# Altium schematic sheet IO_MIL1553_TopConfiguration.SchDoc
size A3; SheetNumber: 13; SheetTotal: 14
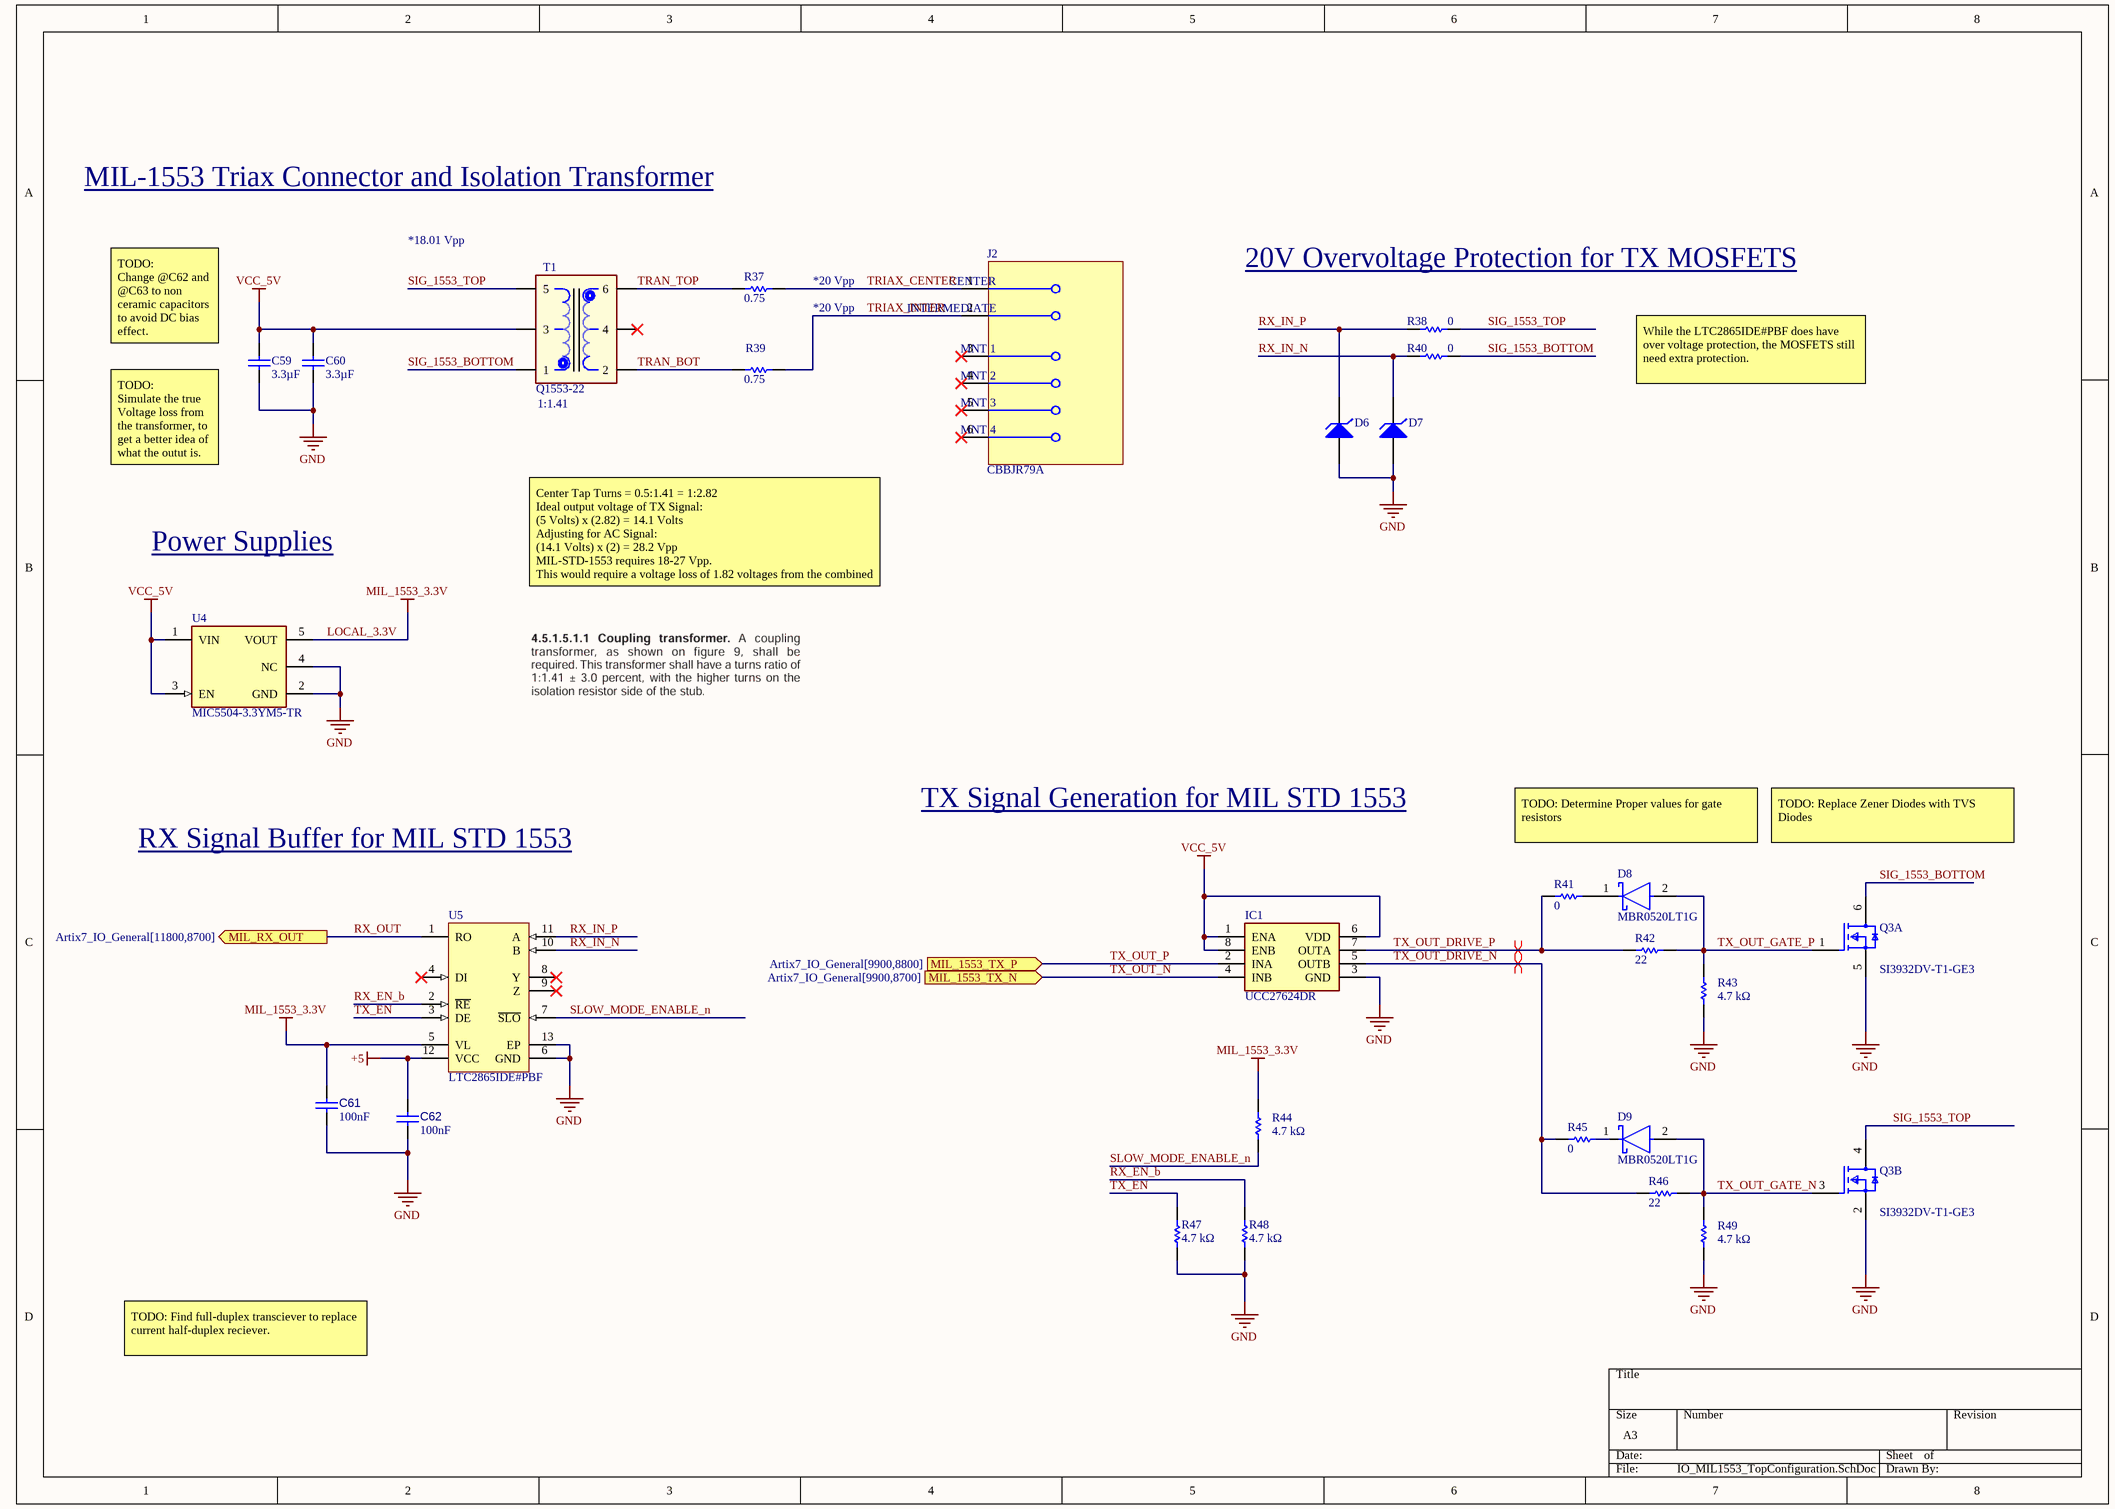
[diagram p0: IO_MIL1553_TopConfiguration.SchDoc]

## Parts
C59  value 3.3µF  [CAPC3325X279X50NL40T25]  (hidden comment: 12105C335KAT2A)
C60  value 3.3µF  [CAPC3325X279X50NL40T25]  (hidden comment: 12105C335KAT2A)
C61  value 100nF  [CAPC2013X145X48ML20T23]  (hidden comment: VJ0805Y104JXXAT)
C62  value 100nF  [CAPC2013X145X48ML20T23]  (hidden comment: VJ0805Y104JXXAT)
D6  SZ1SMA5932BT3G  [ONSC-SMA-2-403D-02_F_V]  (value not drawn)
D7  SZ1SMA5932BT3G  [ONSC-SMA-2-403D-02_F_V]  (value not drawn)
D8  MBR0520LT1G  [FP-425-04-IPC_A]
D9  MBR0520LT1G  [FP-425-04-IPC_A]
IC1  UCC27624DR  [SOIC127P600X175-8N]
J2  CBBJR79A  [CBBJR79A_MFG]
Q3  SI3932DV-T1-GE3  [FP-C-06593-6-IPC_B]  (parts A,B of 2)
R37  value 0.75  [RESC3125X70X40LL20T20]  (hidden comment: RES_0.75ohm_1W _1210)
R38  value 0  [RESC1608X55X25ML10T15]  (hidden comment: Resistor 0R +/- 5% 0603 100 mW)
R39  value 0.75  [RESC3125X70X40LL20T20]  (hidden comment: RES_0.75ohm_1W _1210)
R40  value 0  [RESC1608X55X25ML10T15]  (hidden comment: Resistor 0R +/- 5% 0603 100 mW)
R41  value 0  [RESC1608X55X25ML10T15]  (hidden comment: Resistor 0R +/- 5% 0603 100 mW)
R42  value 22  [RESC1608X55X25LL10T15]  (hidden comment: RC0603FR-0722RL)
R43  Resistance: 4.7 kΩ  [RESC1608X55X30LL15T15]  (hidden comment: ERJ-3EKF4701V)
R44  Resistance: 4.7 kΩ  [RESC1608X55X30LL15T15]  (hidden comment: ERJ-3EKF4701V)
R45  value 0  [RESC1608X55X25ML10T15]  (hidden comment: Resistor 0R +/- 5% 0603 100 mW)
R46  value 22  [RESC1608X55X25LL10T15]  (hidden comment: RC0603FR-0722RL)
R47  Resistance: 4.7 kΩ  [RESC1608X55X30LL15T15]  (hidden comment: ERJ-3EKF4701V)
R48  Resistance: 4.7 kΩ  [RESC1608X55X30LL15T15]  (hidden comment: ERJ-3EKF4701V)
R49  Resistance: 4.7 kΩ  [RESC1608X55X30LL15T15]  (hidden comment: ERJ-3EKF4701V)
T1  Turns Ratio: 1:1.41  [New footprint 1]  (hidden comment: Q1553-22)
U4  MIC5504-3.3YM5-TR  [FP-SOT23-5LD-PL-1-MFG]
U5  LTC2865IDE#PBF  [LT-DE-UE-12_V]

## Ports
MIL_1553_TX_N (in, see Artix7_IO_General[9900,8700]), MIL_1553_TX_P (in, see Artix7_IO_General[9900,8800]), MIL_RX_OUT (out, see Artix7_IO_General[11800,8700])

## Nets
+5: C62.2 U5.12(VCC)
GND: C59.1 C60.1 C61.1 C62.1 D6.2(A) D7.2(A) IC1.3(GND) Q3.2(S2) Q3.5(S1) R43.1 R47.1 R48.2 R49.1 U4.2(GND) U4.4(NC) U5.6(GND) U5.13(EP)
LOCAL_3.3V: C61.2 R44.2 U4.5(VOUT) U5.5(VL)  [also labelled MIL_1553_3.3V]
VCC_5V: C59.2 C60.2 IC1.1(ENA) IC1.6(VDD) IC1.8(ENB) T1.3 U4.1(VIN) U4.3(EN)
RX_EN_b: R48.1 U5.2(~{RE})
RX_IN_N: D7.1(K) R40.1 U5.10(B)
RX_IN_P: D6.1(K) R38.1 U5.11(A)
RX_OUT: U5.1(RO) ; port MIL_RX_OUT
SIG_1553_BOTTOM: Q3.6(D1) R40.2 T1.1
SIG_1553_TOP: Q3.4(D2) R38.2 T1.5
SLOW_MODE_ENABLE_n: R44.1 U5.7(~{SLO})
TRAN_BOT: R39.1 T1.2
TRAN_TOP: R37.1 T1.6
TRIAX_CENTER: J2.1(CENTER) R37.2
TRIAX_INTER: J2.2(INTERMEDIATE) R39.2
TX_EN: R47.2 U5.3(DE)
TX_OUT_DRIVE_N: IC1.5(OUTB) R45.1 R46.1
TX_OUT_DRIVE_P: IC1.7(OUTA) R41.1 R42.1
TX_OUT_GATE_N: D9.2(A) Q3.3(G2) R46.2 R49.2
TX_OUT_GATE_P: D8.2(A) Q3.1(G1) R42.2 R43.2
TX_OUT_N: IC1.4(INB) ; port MIL_1553_TX_N
TX_OUT_P: IC1.2(INA) ; port MIL_1553_TX_P
NetD8_1: D8.1(C) R41.2
NetD9_1: D9.1(C) R45.2

Not connected (* = marked no-connect by the designer): J2 3(MNT_1)* 4(MNT_2)* 5(MNT_3)* 6(MNT_4)*; T1 4*; U5 4(DI)* 8(Y)* 9(Z)*

## Layout directives
differential pair: TX_OUT_DRIVE_N, TX_OUT_DRIVE_P

## Notes on the sheet
- MIL-1553 Triax Connector and Isolation Transformer
- *18.01 Vpp
- (near R37) *20 Vpp
- *20 Vpp
- 20V Overvoltage Protection for TX MOSFETS
- (near C59) TODO:
  Change @C62 and @C63 to non ceramic capacitors to avoid DC bias effect.
- While the LTC2865IDE#PBF does have over voltage protection, the MOSFETS still need extra protection.
- (near C59) TODO:
  Simulate the true Voltage loss from the transformer, to get a better idea of what the outut is.
  Ideal :
  (5 Volts) x (2) = 10 Vpp
- Power Supplies
- Center Tap Turns = 0.5:1.41 = 1:2.82
  Ideal output voltage of TX Signal:
  (5 Volts) x (2.82) = 14.1 Volts
  Adjusting for AC Signal:
  (14.1 Volts) x (2) = 28.2 Vpp
  MIL-STD-1553 requires 18-27 Vpp.
  This would require a voltage loss of 1.82 voltages from the combined losses of the transformer and the TX-Mosfets.
- RX Signal Buffer for MIL STD 1553
- TX Signal Generation for MIL STD 1553
- TODO: Determine Proper values for gate resistors
- TODO: Replace Zener Diodes with TVS Diodes
- (near Q3) SIG_1553_BOTTOM and SIG_1553_TOP are flipped for better component pin placement
- TODO: Find full-duplex transciever to replace current half-duplex reciever.

## Library data of the parts
C59 C60 = CMP-001-00086-1: Ceramic Capacitor, Multilayer, Ceramic, 50V, 10% +Tol, 10% -Tol, X7R, 15% TC, 3.3uF, Surface Mount, 1210; Max Operating Temperature: 125°C; Case/Package: 1210; Min Operating Temperature: -55°C; Pins: 2; Capacitor Type: Ceramic; RoHS Compliant: Yes; Mounting Technology: Surface Mount
C61 C62 = CMP-001-00087-1: Ceramic Capacitor, Multilayer, Ceramic, 25V, 5% +Tol, 5% -Tol, X7R, 15% TC, 0.1uF, Surface Mount, 0805; Min Operating Temperature: -55°C; Case/Package: 0805; Max Operating Temperature: 125°C; Capacitor Type: Ceramic; Mounting Technology: Surface Mount; Pins: 2; RoHS Compliant: Yes
D6 D7 = CMP-004-00033-1: Zener Diode, 20V V(Z), 5%, 0.5W, Silicon, Unidirectional; Min Operating Temperature: -65°C; RoHS Compliant: Yes; Max Operating Temperature: 150°C; Pins: 2
D8 D9 = CMP-004-00035-1: Rectifier Diode, Schottky, 1 Phase, 1 Element, 0.5A, 20V V(RRM), Silicon; Forward Voltage: 385mV; Max Operating Temperature: 125°C; Min Operating Temperature: -65°C; RoHS Compliant: Yes; Pins: 2
IC1 = UCC27624DR: Integrated Circuit; Manufacturer_Name: Texas Instruments; Datasheet Link: https://www.ti.com/lit/ds/symlink/ucc27624.pdf?ts=1654150888910&ref_url=https%253A%252F%252Fwww.ti.com%252Fproduct%252FUCC27624; Height: 1.75mm; Manufacturer_Part_Number: UCC27624DR; Mouser Part Number: 595-UCC27624DR; Mouser Price/Stock: https://www.mouser.co.uk/ProductDetail/Texas-Instruments/UCC27624DR?qs=Rp5uXu7WBW%2FHvRoPIZ55DQ%3D%3D; Arrow Part Number: UCC27624DR; Arrow Price/Stock: https://www.arrow.com/en/products/ucc27624dr/texas-instruments?utm_currency=USD&region=nac; Supplier 1: Digikey; Supplier Part Number 1: 296-UCC27624DRCT-ND
J2 = CMP-12141-47771416-2: RF Triaxial-BNC Connector, Female, Panel Mount, Board And Panel Mount, Solder Terminal, Jack; Number of Contacts: 2; Body Plating: Tin; Frequency: 500MHz; Voltage Rating: 400V; Connector Type: Coaxial, Socket; Body Material: Brass; Dielectric Material: PTFE; Contact Material: Gold; ComponentLink2URL: https://www.belfuse.com/resources/drawings/cinchconnectivitysolutions/trompeter/dr-ccs-trom-cbbjr79a.pdf; Contact Plating: Gold; Housing Color: Silver; Fastening Type: Bayonet; Orientation: Right Angle; REACH SVHC: No SVHC; HelpURL: https://www.belfuse.com/resources/drawings/cinchconnectivitysolutions/trompeter/dr-ccs-trom-cbbjr79a.pdf; Min Operating Temperature: -65°C; Radiation Hardening: No; Max Frequency: 500MHz; RoHS: Compliant; Max Operating Temperature: 165°C; Gender: Female; ComponentLink2Description: Datasheet URL; Mount: Bulkhead, Panel, Through Hole; Termination: Solder
Q3 = CMP-013-00035-1: Small Signal Field-Effect Transistor, 3.7A I(D), 30V, 2-Element, N-Channel, Silicon, Metal-oxide Semiconductor FET; RoHS Compliant: Yes; Max Operating Temperature: 150°C; Pins: 6
R37 R39 = CMP-009-00187-2: Fixed Resistor, Metal Glaze/thick Film, 1W, 0.75ohm, 0.866V, 1% +/-Tol, 100ppm/Cel, Surface Mount, 1210; Power: 1W; RoHS Compliant: Yes; Case/Package: 1210; Pins: 2; Min Operating Temperature: -55°C; Max Operating Temperature: 155°C; Mounting Technology: Surface Mount; Tolerance: 1%
R38 R40 R41 R45 = CMP-009-00006-5: Chip Resistor, 0 Ohm, 0.1 W, -55 to 155 degC, 0603 (1608 Metric); Power: 100mW; Voltage Rating: 50V; Max Operating Temperature: 155°C; RoHS Compliant: True; Mounting Technology: SM; Case/Package: 0603; Min Operating Temperature: -55°C; Tolerance: 5%; Pins: 2
R42 R46 = CMP-009-00189-1: Fixed Resistor, Metal Glaze/thick Film, 0.1W, 22ohm, 75V, 1% +/-Tol, 100ppm/Cel, Surface Mount, 0603; Power: 100mW; Min Operating Temperature: -55°C; RoHS Compliant: Yes; Mounting Technology: Surface Mount; Case/Package: 0603; Tolerance: 1%; Max Operating Temperature: 155°C; Pins: 2
R43 R44 R47-R49 = CMP-009-00185-1: Fixed Resistor, Metal Glaze/thick Film, 0.1W, 4700ohm, 75V, 1% +/-Tol, 100ppm/Cel, Surface Mount, 0603; Power: 100mW; Value: 4.7k; Max Operating Temperature: 155°C; Tolerance: 1%; Mounting Technology: Surface Mount; RoHS Compliant: Yes; Min Operating Temperature: -55°C; Case/Package: 0603; Pins: 2
T1 = CMP-012-00001-4: Pulse Transformer, GENERAL PURPOSE Application(s), 1CT:1.41CT; Pin Width Tolerance: 0.050 mm; Pin Width: 0.51 mm; Pins: 6; Case/Package: THT; Min Operating Temperature: -55°C; Max Operating Temperature: 130°C; Mounting Technology: Through Hole
U4 = CMP-2000-07604-2: IC REG LINEAR 3.3V 300MA SOT23-5; Quiescent Current: 38uA; Operating Supply Current: 42uA; Max Input Voltage: 5.5V; Min Input Voltage: 2.5V; Output Type: Fixed; Power Supply Rejection Ratio (PSRR): 60dB; Dropout Voltage: 380mV; Accuracy: 3%; Number of Outputs: 1; Nominal Output Voltage: 3.3V; Max Output Current: 300mA; Length: 2.9mm; Mount: Surface Mount; Width: 1.6mm; Packaging: Tape and Reel; Output Current: 300mA; Min Operating Temperature: -40°C; Max Operating Temperature: 125°C; Height: 1.1mm; Case/Package: SOT-23-5; REACH SVHC: No SVHC; Number of Pins: 5; Output Voltage: 3.3V
U5 = CMP-015-00008-1: Line Transceiver, 1 Func, 1 Driver, 1 Rcvr, CMOS, PDSO12; Max Supply Voltage: 5.5V; Min Supply Voltage: 3V; Nominal Supply Voltage: 3.3V; Case/Package: HVSON; Max Operating Temperature: 85°C; Min Operating Temperature: -40°C; RoHS Compliant: Yes; Pins: 12; ComponentLink1Description: Datasheet Link; ComponentLink1URL: https://www.analog.com/media/en/technical-documentation/data-sheets/2862345fc.pdf